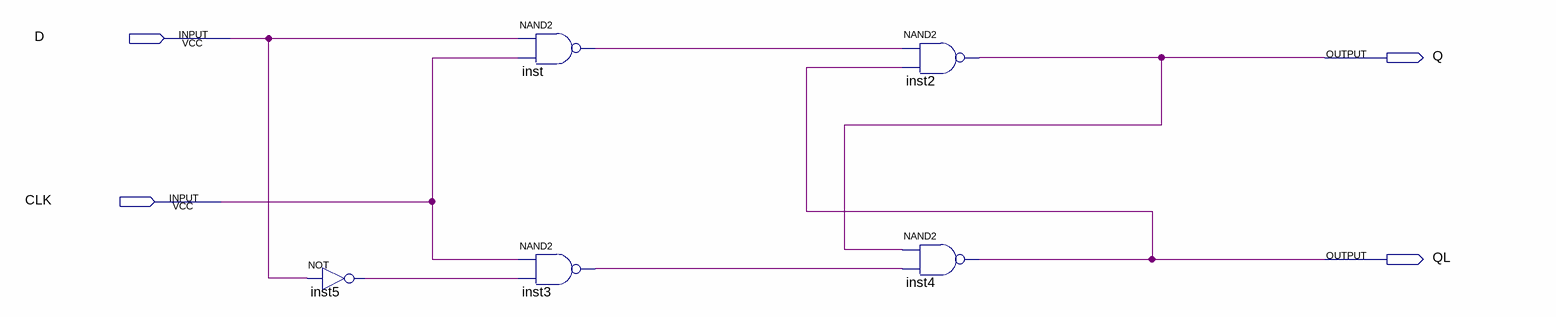
[diagram p0: schematic sheet]
// Quartus schematic Data_flip_flop.bdf as structural Verilog: 5 symbols, 4 pins
module Data_flip_flop (
  input  D,
  input  CLK,
  output Q,
  output QL
);

  wire inst3_out, inst5_out, inst_out;

  not inst5 (inst5_out, D);
  nand inst (inst_out, D, CLK);
  nand inst3 (inst3_out, CLK, inst5_out);
  nand inst2 (Q, inst_out, QL);
  nand inst4 (QL, Q, inst3_out);
endmodule
